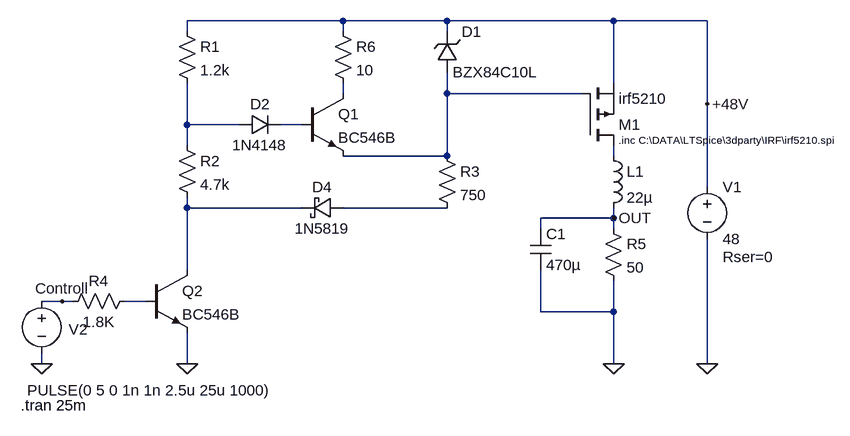
[diagram p0: schematic driver_filtered.asc]
driver_filtered.asc, the LTspice schematic file:
Version 4
SHEET 1 908 680
WIRE 96 -128 -144 -128
WIRE 256 -128 96 -128
WIRE 512 -128 256 -128
WIRE 656 -128 512 -128
WIRE -144 -112 -144 -128
WIRE 96 -112 96 -128
WIRE 256 -112 256 -128
WIRE 512 -32 512 -128
WIRE 96 -16 96 -32
WIRE 256 -16 256 -48
WIRE 464 -16 256 -16
WIRE 656 0 656 -128
WIRE -144 32 -144 -32
WIRE -64 32 -144 32
WIRE 32 32 0 32
WIRE -144 64 -144 32
WIRE 256 80 256 -16
WIRE 256 80 96 80
WIRE 512 80 512 64
WIRE 656 128 656 0
WIRE -144 160 -144 144
WIRE 32 160 -144 160
WIRE 256 160 96 160
WIRE 512 176 512 160
WIRE 512 176 400 176
WIRE 400 192 400 176
WIRE 512 192 512 176
WIRE -144 256 -144 160
WIRE -336 304 -368 304
WIRE -320 304 -336 304
WIRE -208 304 -240 304
WIRE 400 320 400 256
WIRE 512 320 512 272
WIRE 512 320 400 320
WIRE -368 400 -368 384
WIRE -144 400 -144 352
WIRE 512 400 512 320
WIRE 656 400 656 208
FLAG -144 400 0
FLAG 512 400 0
FLAG 656 400 0
FLAG -368 400 0
FLAG 656 0 +48V
FLAG -336 304 Controll
FLAG 512 176 OUT
SYMBOL pmos 464 64 M180
SYMATTR InstName M1
SYMATTR Value irf5210
SYMATTR Prefix X
SYMBOL zener 272 -48 R180
WINDOW 0 -37 63 Left 2
WINDOW 3 -124 1 Left 2
SYMATTR InstName D1
SYMATTR Value BZX84C10L
SYMBOL diode -64 48 R270
WINDOW 0 32 32 VTop 2
WINDOW 3 0 32 VBottom 2
SYMATTR InstName D2
SYMATTR Value 1N4148
SYMBOL npn 32 -16 R0
SYMATTR InstName Q1
SYMATTR Value BC546B
SYMBOL npn -208 256 R0
SYMATTR InstName Q2
SYMATTR Value BC546B
SYMBOL res -160 -128 R0
SYMATTR InstName R1
SYMATTR Value 1.2k
SYMBOL res -160 48 R0
SYMATTR InstName R2
SYMATTR Value 4.7k
SYMBOL res 240 64 R0
SYMATTR InstName R3
SYMATTR Value 750
SYMATTR SpiceLine pwr=2
SYMBOL res -224 288 R90
WINDOW 0 0 56 VBottom 2
WINDOW 3 32 56 VTop 2
SYMATTR InstName R4
SYMATTR Value 1.8K
SYMBOL res 496 176 R0
SYMATTR InstName R5
SYMATTR Value 50
SYMBOL voltage 656 112 R0
WINDOW 123 0 0 Left 2
WINDOW 39 24 124 Left 2
SYMATTR SpiceLine Rser=0
SYMATTR InstName V1
SYMATTR Value 48
SYMBOL voltage -368 288 R0
WINDOW 0 42 59 Left 2
WINDOW 3 -22 153 Left 2
WINDOW 123 0 0 Left 2
WINDOW 39 0 0 Left 2
SYMATTR InstName V2
SYMATTR Value PULSE(0 5 0 1n 1n 2.5u 25u 1000)
SYMBOL schottky 96 144 R90
WINDOW 0 0 32 VBottom 2
WINDOW 3 32 32 VTop 2
SYMATTR InstName D4
SYMATTR Value 1N5819
SYMBOL res 80 -128 R0
SYMATTR InstName R6
SYMATTR Value 10
SYMBOL cap 384 192 R0
SYMATTR InstName C1
SYMATTR Value 470µ
SYMATTR SpiceLine Rser=64m
SYMBOL ind 496 64 R0
SYMATTR InstName L1
SYMATTR Value 22µ
SYMATTR SpiceLine Rser=5m
TEXT 520 56 Left 1 !.inc C:\\DATA\\LTSpice\\3dparty\\IRF\\irf5210.spi
TEXT -400 464 Left 2 !.tran 25m

The netlist it stands for:
* driver_filtered.asc
XM1 N005 N002 +48V irf5210  ; pins D G S
D1 N002 +48V BZX84C10L
D2 N003 N004 1N4148
Q1 N001 N004 N002 0 BC546B
Q2 N006 N008 0 0 BC546B
R1 +48V N003 1.2k
R2 N003 N006 4.7k
R3 N002 N007 750 pwr=2
R4 N008 Controll 1.8K
R5 OUT 0 50
V1 +48V 0 48 Rser=0
V2 Controll 0 PULSE(0 5 0 1n 1n 2.5u 25u 1000)
D4 N007 N006 1N5819
R6 +48V N001 10
C1 OUT 0 470µ Rser=64m
L1 N005 OUT 22µ Rser=5m
.model D D
.lib standard.dio
.model NPN NPN
.model PNP PNP
.lib standard.bjt
.inc C:\DATA\LTSpice\3dparty\IRF\irf5210.spi
.tran 25m
.backanno
.end